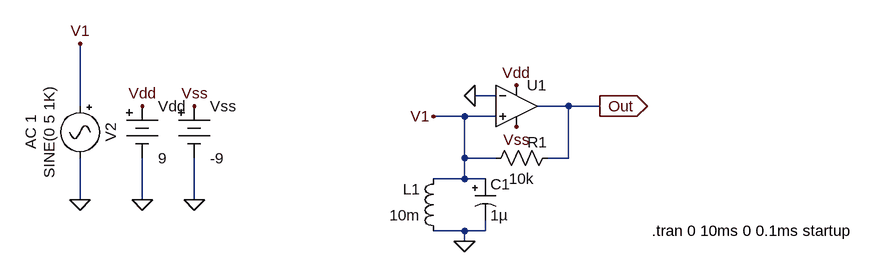
[diagram p0: schematic LC oscillator example.asc]
LC oscillator example.asc, the LTspice schematic file:
Version 4
SHEET 1 880 680
WIRE 176 112 144 112
WIRE -464 128 -464 32
WIRE 288 128 240 128
WIRE 336 128 288 128
WIRE 128 144 80 144
WIRE 176 144 128 144
WIRE 128 208 128 144
WIRE 176 208 128 208
WIRE 288 208 288 128
WIRE 288 208 256 208
WIRE 128 240 128 208
WIRE 128 240 80 240
WIRE 160 240 128 240
WIRE -464 272 -464 208
WIRE -368 272 -368 208
WIRE -288 272 -288 208
WIRE 128 320 80 320
WIRE 160 320 160 304
WIRE 160 320 128 320
WIRE 128 336 128 320
FLAG 144 112 0
FLAG -368 272 0
FLAG 128 336 0
FLAG -288 272 0
FLAG -464 272 0
FLAG 80 144 V1
FLAG -464 32 V1
FLAG -368 128 Vdd
FLAG 208 96 Vdd
FLAG 208 160 Vss
FLAG -288 128 Vss
FLAG 336 128 Out
IOPIN 336 128 Out
SYMBOL OpAmps\\UniversalOpAmp2 208 128 R0
SYMATTR InstName U1
SYMBOL res 272 192 R90
WINDOW 0 7 32 VBottom 2
WINDOW 3 32 56 VTop 2
SYMATTR InstName R1
SYMATTR Value 10k
SYMBOL ind 96 336 R180
WINDOW 0 36 80 Left 2
WINDOW 3 36 40 Left 2
SYMATTR InstName L1
SYMATTR Value 10m
SYMBOL polcap 144 240 R0
SYMATTR InstName C1
SYMATTR Value 1µ
SYMATTR Description Capacitor
SYMATTR Type cap
SYMATTR SpiceLine V=6.3 Irms=0 Rser=4 Lser=0
SYMBOL Misc\\battery -288 112 R0
WINDOW 123 0 0 Left 0
WINDOW 39 0 0 Left 0
SYMATTR InstName Vss
SYMATTR Value -9
SYMBOL Misc\\signal -464 112 M0
WINDOW 0 -32 56 VBottom 2
WINDOW 3 32 56 VTop 2
WINDOW 123 60 56 VTop 2
WINDOW 39 0 0 Left 0
SYMATTR InstName V2
SYMATTR Value SINE(0 5 1K)
SYMATTR Value2 AC 1
SYMBOL Misc\\battery -368 112 R0
WINDOW 123 0 0 Left 0
WINDOW 39 0 0 Left 0
SYMATTR InstName Vdd
SYMATTR Value 9
TEXT 416 320 Left 2 !.tran 0 10ms 0 0.1ms startup

The netlist it stands for:
* LC oscillator example.asc
XU1 V1 0 Vdd Vss Out level2 Avol=1Meg GBW=10Meg Slew=10Meg Ilimit=25m Rail=0 Vos=0 En=0 Enk=0 In=0 Ink=0 Rin=500Meg  ; pins In+ In- V+ V- OUT
R1 Out V1 10k
L1 0 V1 10m
C1 V1 0 1µ V=6.3 Irms=0 Rser=4 Lser=0
Vss Vss 0 -9
V2 V1 0 SINE(0 5 1K) AC 1
Vdd Vdd 0 9
.tran 0 10ms 0 0.1ms startup
.lib UniversalOpAmp2.lib
.backanno
.end